# EAGLE schematic v1.0 (EAGLE 9.1.0)
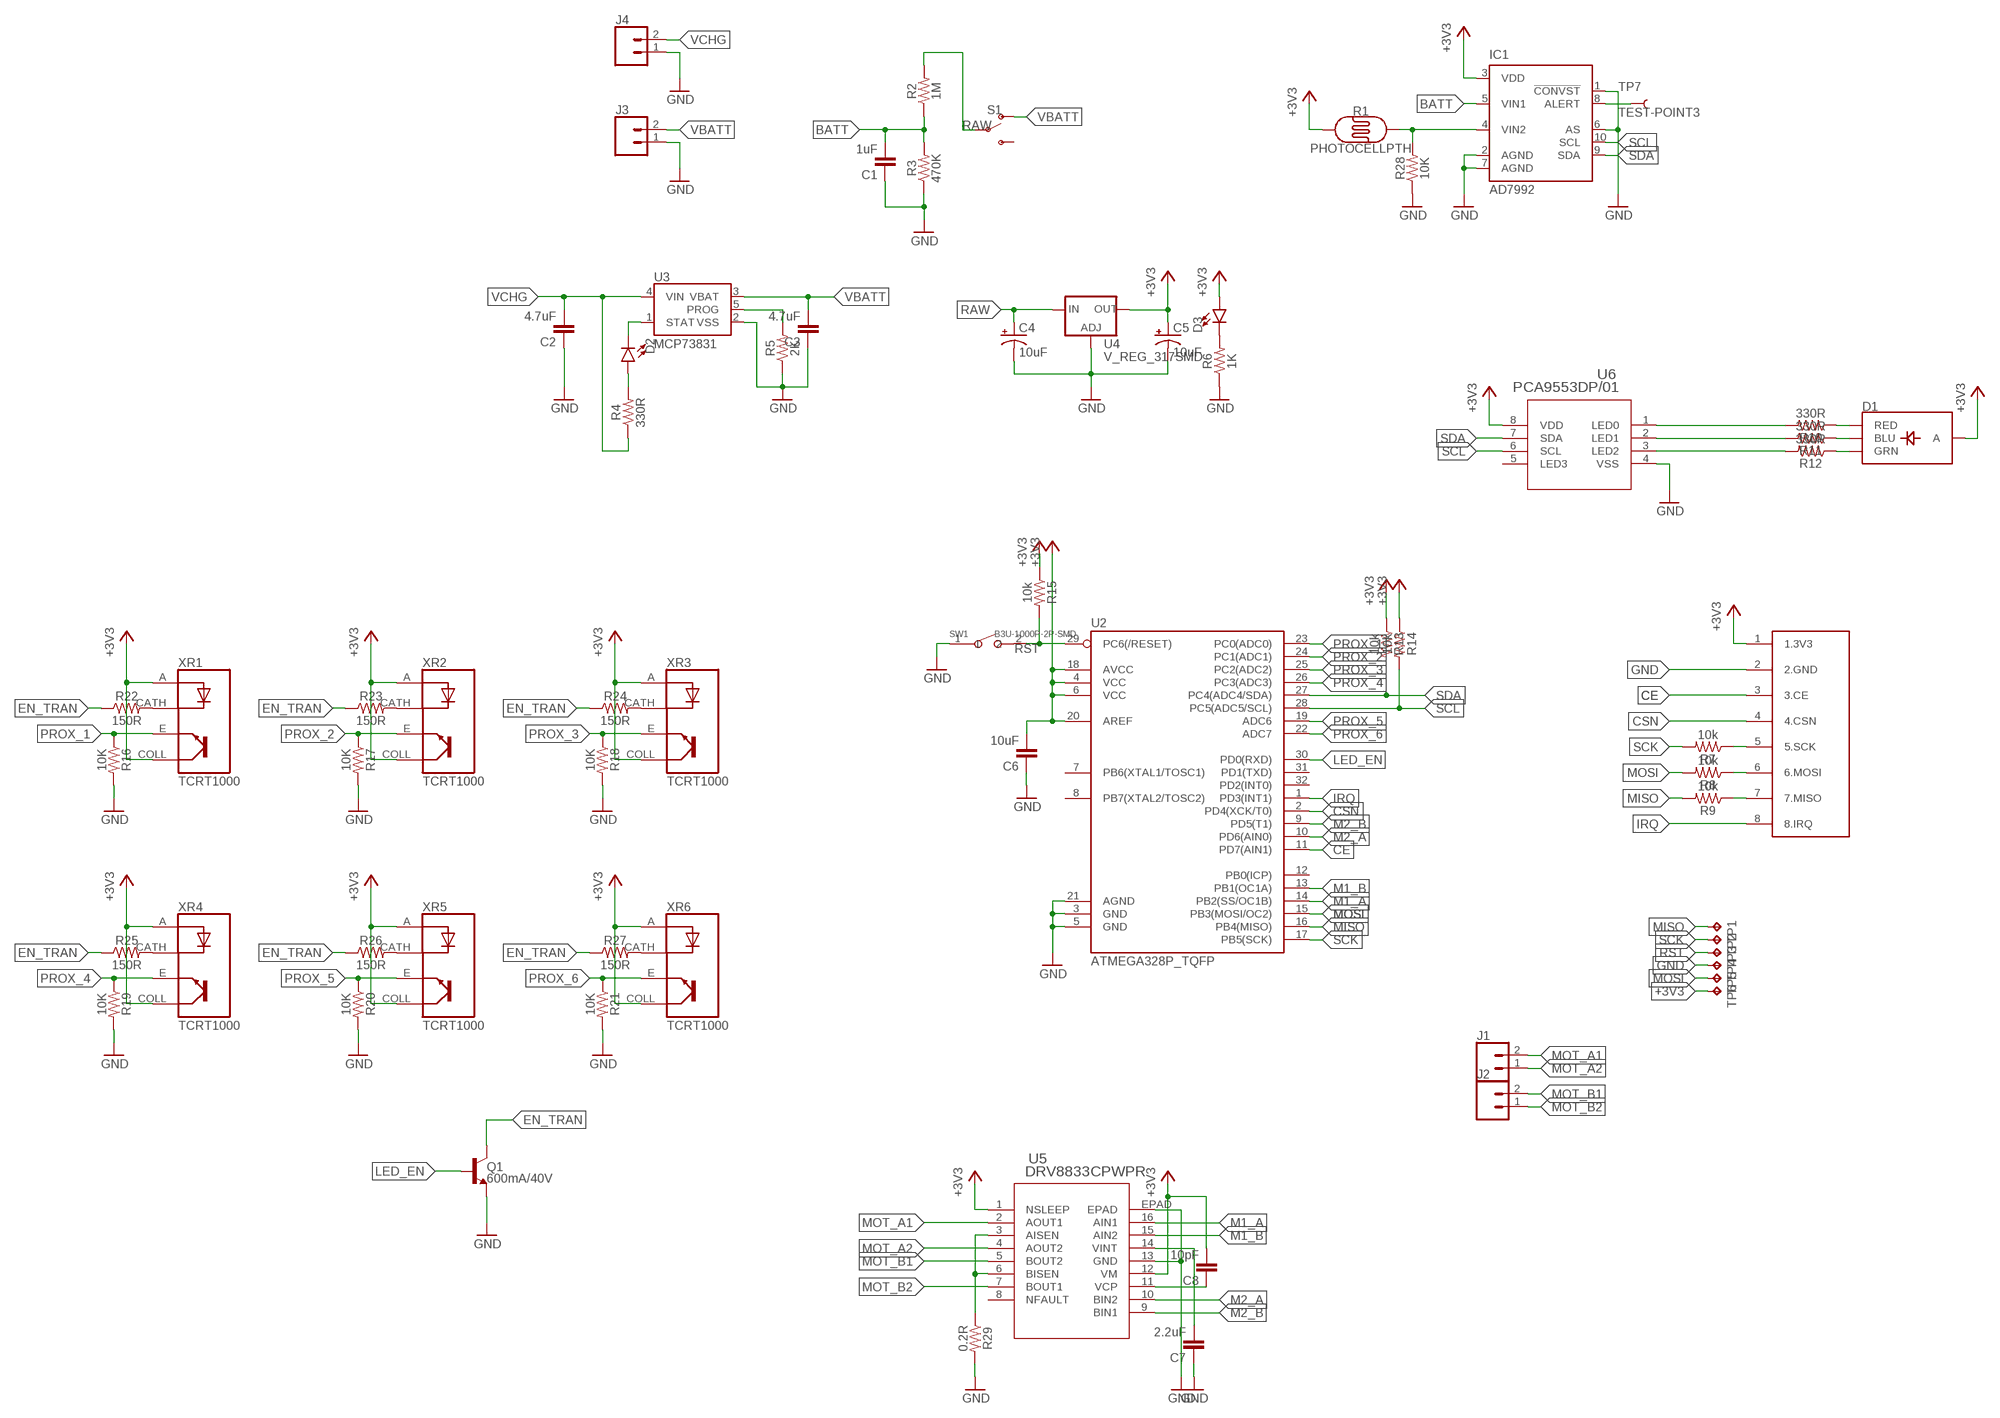
[diagram p0: schematic, sheet 1]

## Parts
C1  1uF  C-EUC0603  [C0603]
C2  4.7uF  C-EUC0603  [C0603]
C3  4.7uF  C-EUC0603  [C0603]
C4  10uF  10UF-POLAR-EIA3216-16V-10%(TANT)  [EIA3216]
C5  10uF  10UF-POLAR-EIA3216-16V-10%(TANT)  [EIA3216]
C6  10uF  C-EUC0603  [C0603]
C7  2.2uF  C-EUC0603  [C0603]
C8  10pF  C-EUC0603  [C0603]
D1  LED-RGB-CASMD  [LED-TRICOLOR-SMD]
D2  LED0603  [LED-0603]
D3  LED0603  [LED-0603]
IC1  AD7992  [MSOP10]
J1  CONN_02  [1X02]
J2  CONN_02  [1X02]
J3  CONN_02  [1X02]
J4  CONN_02  [1X02]
Q1  600mA/40V  TRANS_NPN-MMBT2222AL  [SOT23-3]
R1  PHOTOCELLPTH  [PHOTOCELL]
R2  1M  RESISTOR0402  [0402]
R3  470K  RESISTOR0402  [0402]
R4  330R  RESISTOR0402  [0402]
R5  2K  RESISTOR0402  [0402]
R6  1K  RESISTOR0402  [0402]
R7  10k  RESISTOR0402  [0402]
R8  10k  RESISTOR0402  [0402]
R9  10k  RESISTOR0402  [0402]
R10  330R  RESISTOR0402  [0402]
R11  330R  RESISTOR0402  [0402]
R12  330R  RESISTOR0402  [0402]
R13  10k  RESISTOR0402  [0402]
R14  10k  RESISTOR0402  [0402]
R15  10k  RESISTOR0402  [0402]
R16  10K  RESISTOR0402  [0402]
R17  10K  RESISTOR0402  [0402]
R18  10K  RESISTOR0402  [0402]
R19  10K  RESISTOR0402  [0402]
R20  10K  RESISTOR0402  [0402]
R21  10K  RESISTOR0402  [0402]
R22  150R  RESISTOR0402  [0402]
R23  150R  RESISTOR0402  [0402]
R24  150R  RESISTOR0402  [0402]
R25  150R  RESISTOR0402  [0402]
R26  150R  RESISTOR0402  [0402]
R27  150R  RESISTOR0402  [0402]
R28  10K  RESISTOR0402  [0402]
R29  0.2R  RESISTOR0402  [0402]
S1  SWITCH-SPDT-SMD-RIGHT-ANGLE  [SWITCH_SPST_SMD_A]
SW1  B3U-1000P-2P-SMD  SMD-BUTTON(2P-3.0X2.5X1.2+0.4MM)-B3U-1000P-2P-SMD  [SW2-2.6-3.0X2.5X1.2+0.4MM]
TP1  TPB1,27  [B1,27]
TP2  TPB1,27  [B1,27]
TP3  TPB1,27  [B1,27]
TP4  TPB1,27  [B1,27]
TP5  TPB1,27  [B1,27]
TP6  TPB1,27  [B1,27]
TP7  TEST-POINT3  [PAD.03X.03]
U2  ATMEGA328P_TQFP  [TQFP32-08]
U3  MCP73831  [SOT23-5]
U4  V_REG_317SMD  [SOT223]
U5  DRV8833CPWPR  [PWP16_2P31X2P46]
U6  PCA9553DP/01  [SOT505-1]
U$1  NRF24L01+  [NRF24L01+]
XR1  TCRT1000  [XDCR_TCRT1000]
XR2  TCRT1000  [XDCR_TCRT1000]
XR3  TCRT1000  [XDCR_TCRT1000]
XR4  TCRT1000  [XDCR_TCRT1000]
XR5  TCRT1000  [XDCR_TCRT1000]
XR6  TCRT1000  [XDCR_TCRT1000]

## Nets
+3V3: C5.+ C6.2 C8.2 D1.A D3.A IC1.3(VDD) R1.1 R13.1 R14.1 R15.1 TP6.TP U2.4(VCC) U2.6(VCC) U2.18(AVCC) U2.20(AREF) U4.2(OUT) U5.1(NSLEEP) U5.12(VM) U6.8(VDD) U$1.1(1.3V3) XR1.A XR1.COLL(CO) XR2.A XR2.COLL(CO) XR3.A XR3.COLL(CO) XR4.A XR4.COLL(CO) XR5.A XR5.COLL(CO) XR6.A XR6.COLL(CO)
BATT: C1.2 IC1.5(VIN1) R2.1 R3.2
CE: U2.11(PD7(AIN1)) U$1.3(3.CE)
CSN: U2.2(PD4(XCK/T0)) U$1.4(4.CSN)
EN_TRAN: Q1.3(C) R22.1 R23.1 R24.1 R25.1 R26.1 R27.1
GND: C1.1 C2.1 C3.1 C4.- C5.- C6.1 C7.1 IC1.1(!CONVST) IC1.2(AGND) IC1.6(AS) IC1.7(AGND) J3.1 J4.1 Q1.2(E) R3.1 R5.1 R6.1 R16.2 R17.2 R18.2 R19.2 R20.2 R21.2 R28.1 R29.2 SW1.1 TP4.TP U2.3(GND) U2.5(GND) U2.21(AGND) U3.2(VSS) U4.1(ADJ) U5.13(GND) U5.EPAD U6.4(VSS) U$1.2(2.GND)
IRQ: U2.1(PD3(INT1)) U$1.8(8.IRQ)
LED_EN: Q1.1(B) U2.30(PD0(RXD))
M1_A: U2.14(PB2(SS/OC1B)) U5.16(AIN1)
M1_B: U2.13(PB1(OC1A)) U5.15(AIN2)
M2_A: U2.10(PD6(AIN0)) U5.10(BIN2)
M2_B: U2.9(PD5(T1)) U5.9(BIN1)
MISO: R9.2 TP1.TP U2.16(PB4(MISO))
MOSI: R8.2 TP5.TP U2.15(PB3(MOSI/OC2))
MOT_A1: J1.2 U5.2(AOUT1)
MOT_A2: J1.1 U5.4(AOUT2)
MOT_B1: J2.2 U5.5(BOUT2)
MOT_B2: J2.1 U5.7(BOUT1)
N$1: R7.1 U$1.5(5.SCK)
N$2: R8.1 U$1.6(6.MOSI)
N$3: D3.C R6.2
N$4: D2.C U3.1(STAT)
N$5: D2.A R4.2
N$6: R9.1 U$1.7(7.MISO)
N$7: D1.R(RED) R10.1
N$8: D1.B(BLU) R11.1
N$9: R5.2 U3.5(PROG)
N$10: D1.G(GRN) R12.1
N$11: R29.1 U5.3(AISEN) U5.6(BISEN)
N$12: IC1.4(VIN2) R1.2 R28.2
N$13: IC1.8(ALERT) TP7.P$1
N$14: C7.2 U5.14(VINT)
N$15: C8.1 U5.11(VCP)
N$20: R22.2 XR1.CATH(C)
N$23: R23.2 XR2.CATH(C)
N$24: R24.2 XR3.CATH(C)
N$25: R25.2 XR4.CATH(C)
N$27: R26.2 XR5.CATH(C)
N$29: R27.2 XR6.CATH(C)
PROX_1: R16.1 U2.23(PC0(ADC0)) XR1.E
PROX_2: R17.1 U2.24(PC1(ADC1)) XR2.E
PROX_3: R18.1 U2.25(PC2(ADC2)) XR3.E
PROX_4: R19.1 U2.26(PC3(ADC3)) XR4.E
PROX_5: R20.1 U2.19(ADC6) XR5.E
PROX_6: R21.1 U2.22(ADC7) XR6.E
RAW: C4.+ R2.2 S1.2(P) U4.3(IN)
RGB-1: R10.2 U6.1(LED0)
RGB-2: R11.2 U6.2(LED1)
RGB-3: R12.2 U6.3(LED2)
RST: R15.2 SW1.2 TP3.TP U2.29(PC6(/RESET))
SCK: R7.2 TP2.TP U2.17(PB5(SCK))
SCL: IC1.10(SCL) R14.2 U2.28(PC5(ADC5/SCL)) U6.6(SCL)
SDA: IC1.9(SDA) R13.2 U2.27(PC4(ADC4/SDA)) U6.7(SDA)
VBATT: C3.2 J3.2 S1.1(O) U3.3(VBAT)
VCHG: C2.2 J4.2 R4.1 U3.4(VIN)
Unconnected: S1.3(S) U2.7(PB6(XTAL1/TOSC1)) U2.8(PB7(XTAL2/TOSC2)) U2.12(PB0(ICP)) U2.31(PD1(TXD)) U2.32(PD2(INT0)) U5.8(NFAULT) U6.5(LED3)

## Library data of the parts
C1-C3 C6-C8 = resistor:C-EU: CAPACITOR, European symbol
C4 C5 = SparkFun-Capacitors:10UF-POLAR: 10.0µF polarized capacitors A capacitor is a passive two-terminal electrical component used to store electrical energy temporarily in an electric field.; PROD_ID: CAP-00811
D1 = thesis:LED-RGB-CA: LED-RGB Diffused Common Anode Packages: LED RGB-THRU P-LCC-4-3 LED-TRICOLOR-SMD SparkFun Products: RGB Diffused Common Anode- Diffuse <[https://www.sparkfun.com/products/10821]> RGB Diffused Common Anode - Clear <[https://www.sparkfun.com/products/10820]> Qduino Mini <[https://www.sparkfun.com/products/13614]> Triple Output LED RGB - SMD <https://www.sparkfun.com/products/7844>; PROD_ID: DIO-08324
D2 D3 = SparkFun-LED:LED: LED (Generic) Standard schematic elements and footprints for 5mm, 3mm, 1206, and 0603 sized LEDs. Generic LEDs with no color specified.
IC1 = analog-devices:AD7992: 2-Channel, 12-Bit ADC with I2C-Compatible Interface 10-Lead MSOP Source: http://www.analog.com/UploadedFiles/Data_Sheets/224965274AD7992_0.pdf; MPN: AD7992BRMZ-0; OC_FARNELL: 1078311; OC_NEWARK: 31M4422
J1-J4 = SparkFun-Connectors:CONN_02: Multi connection point. Often used as Generic Header-pin footprint for 0.1 inch spaced/style header connections On any of the 0.1 inch spaced packages, you can populate with these: Break Away Headers - Straight <https://www.sparkfun.com/products/116> (PRT-00116) Break Away Male Headers - Right Angle <https://www.sparkfun.com/products/553> (PRT-00553) Female Headers <https://www.sparkfun.com/products/115> (PRT-00115) Break Away Headers - Machine Pin <https://www.sparkfun.com/products/117> (PRT-00117) Break Away Female Headers - Swiss Machine Pin <https://www.sparkfun.com/products/743> (PRT-00743) For SCREWTERMINALS and SPRING TERMINALS visit here: Screw Terimnals on SparkFun.com <https://www.sparkfun.com/search/results?term=Screw+Terminals> (5mm/3.5mm/2.54mm spacing) This device is also useful as a general connection point to wire up your design to another part of your project. Our various solder wires solder well into these plated through hole pads. Hook-Up Wire - Assortment (Stranded, 22 AWG) <https://www.sparkfun.com/products/11375> (PRT-11375) Hook-Up Wire - Assortment (Solid Core, 22 AWG) <https://www.sparkfun.com/products/11367> (PRT-11367) View the entire wire category on our website here <https://www.sparkfun.com/categories/141> Special notes: Molex polarized connector foot print use with: PRT-08233 with associated crimp pins and housings. 2.54_SCREWTERM for use with PRT-10571. 3.5mm Screw Terminal footprints for PRT-08084 5mm Screw Terminal footprints for use with PRT-08432
Q1 = SparkFun-DiscreteSemi:TRANS_NPN: NPN transistor Current controlled devices typically used to amplify current or used as a switch. BC547 - COM-08928 <http://www.sparkfun.com/products/8928> (TO-92 45V 100mA) (1.Collector 2.Base 3.Emitter) 2N3904 - COM-00521 <http://www.sparkfun.com/products/521> (TO-92 40V 200mA) (1.Emitter 2.Base 3.Collector) P2N2222A - COM-12852 <http://www.sparkfun.com/products/12852> (TO-92 40V 600mA) (1.Collector 2.Base 3.Emitter); PROD_ID: TRANS-08049
R1 = SparkFun-Sensors:PHOTOCELL: Photocell (Photodetector, Photo Resistor, CdS) This is a very small light sensor. A photocell changes (also called a photodetector, photo resistor, CdS or photoconductive cell) resistance depending on the amount of light it is exposed to. These little sensors make great ambient light triggers (when light in the room turns on, do something). Datasheet <http://cdn.sparkfun.com/datasheets/Sensors/LightImaging/SEN-09088.pdf> SparkFun Products Mini Photocell <https://www.sparkfun.com/products/9088> (SEN-09088); PROD_ID: COMP-09129; SF_ID: SEN-09088
R2-R29 = SparkFun-Resistors:RESISTOR: Generic Resistor Package
S1 = SparkFun-Switches:SWITCH-SPDT: Single Pole, Double Throw (SPDT) Switch Single-pole, double-throw (SPDT) switch. Variant Overview SMD-AYZ0202 Surface Mount DPDT Switch <https://www.sparkfun.com/products/597> (COM-00597) Used on e.g. LilyPad Arduino USB - ATmega32U4 Board <https://www.sparkfun.com/products/12049> PTH-11.6X4.0MM SPDT Mini Power Switch <https://www.sparkfun.com/products/102> (COM-00102) Used on e.g. SparkFun Simon Says - Through-Hole Soldering Kit <https://www.sparkfun.com/products/10547> (KIT-10547) PTH-11.6X4.0MM-KIT KIT version of SPDT Mini Power Switch - Simplifies soldering by removing tStop of switch pins - only one side can be soldered. PTH-11.6X4.0MM-LOCK LOCK version of SPDT Mini Power Switch - Offset pins hold switch in place for easier soldering. SMD-RIGHT-ANGLE Surface Mount Right Angle Switch <https://www.sparkfun.com/products/10860> (COM-10860) Used on e.g. SparkFun ESP8266 Thing <https://www.sparkfun.com/products/13231>; PROD_ID: SWCH-10651; SF_SKU: COM-10860
SW1 = Seeed-Switch:SMD-BUTTON(2P-3.0X2.5X1.2+0.4MM): 311020047; MPN: B3U-1000P-2P-SMD
TP1-TP6 = testpad:TP: Test pad
TP7 = SparkFun-Connectors:TEST-POINT: SparkFun Test Points Bare copper test points for troubleshooting or In-Circuit-Testing. These are used by our Production team for verifying production board runs using pogo-pins on test beds. SparkFun Products: SparkFun LSM9DS1 Breakout <https://www.sparkfun.com/products/13284> SparkFun PSOC <https://www.sparkfun.com/products/13714> SparkFun Load Cell Amplifier <https://www.sparkfun.com/products/13879>
U2 = thesis:ATMEGA328P_TQFP: Popular 328P in QFP Storefront component: ATmega328 - TQFP <https://www.sparkfun.com/products/13448> (COM-13448) Datasheet <http://www.sparkfun.com/datasheets/Components/SMD/ATMega328.pdf> SparkFun Products SparkFun RedBoard - Programmed with Arduino <https://www.sparkfun.com/products/12757> (DEV-12757) Arduino Pro Mini 328 - 5V/16MHz <https://www.sparkfun.com/products/11113> (DEV-11113) Arduino Pro Mini 328 - 3.3V/8MHz <https://www.sparkfun.com/products/11114> (DEV-11114) SparkFun OpenLog <https://www.sparkfun.com/products/13712> (DEV-13712) SparkFun MicroView - OLED Arduino Module <https://www.sparkfun.com/products/12923> (DEV-12923) SparkFun Digital Sandbox <https://www.sparkfun.com/products/12651> (DEV-12651) SparkFun PicoBoard <https://www.sparkfun.com/products/11888> (WIG-11888) Arduino Fio <https://www.sparkfun.com/products/10116> (DEV-10116) LilyPad Arduino 328 Main Board <https://www.sparkfun.com/products/13342> (DEV-13342) SparkFun RedStick <https://www.sparkfun.com/products/13741> (DEV-13741) LilyPad MP3 <https://www.sparkfun.com/products/11013> (DEV-11013) LilyPad Arduino SimpleSnap <https://www.sparkfun.com/products/10941> (DEV-10941) SparkFun Stepoko <https://www.sparkfun.com/products/13899> (ROB-13899) SparkFun Geiger Counter <https://www.sparkfun.com/products/11345> (SEN-11345) SparkFun EL Sequencer <https://www.sparkfun.com/products/12781> (COM-12781) Arduino Pro 328 - 5V/16MHz <https://www.sparkfun.com/products/10915> (DEV-10915) CryptoCape <https://www.sparkfun.com/products/12773> (DEV-12773) SparkFun IR Thermometer Evaluation Board - MLX90614 <https://www.sparkfun.com/products/10740> (SEN-10740) SparkFun RedBot Mainboard <https://www.sparkfun.com/products/12097> (ROB-12097) Arduino Pro 328 - 3.3V/8MHz <https://www.sparkfun.com/products/10914> (DEV-10914) SparkFun Block for Intel® Edison - Arduino <https://www.sparkfun.com/products/13036> (DEV-13036) SparkFun Simon Says - Surface Mount Soldering Kit <https://www.sparkfun.com/products/10935> (KIT-10935) SparkFun 7-Segment Serial Display - Red <https://www.sparkfun.com/products/11441> (COM-11441) SparkFun 7-Segment Serial Display - White <https://www.sparkfun.com/products/11629> (COM-11629) SparkFun 7-Segment Serial Display - Yellow <https://www.sparkfun.com/products/11443> (COM-11443) SparkFun 7-Segment Serial Display - Kelly Green <https://www.sparkfun.com/products/11440> (COM-11440) SparkFun 7-Segment Serial Display - Blue <https://www.sparkfun.com/products/11442> (COM-11442) SparkFun OpenSegment Serial Display - 20mm (Blue) <https://www.sparkfun.com/products/11647> (COM-11647) SparkFun OpenSegment Serial Display - 20mm (Green) <https://www.sparkfun.com/products/11646> (COM-11646) SparkFun OpenSegment Serial Display - 20mm (White) <https://www.sparkfun.com/products/11648> (COM-11648) SparkFun OpenSegment Serial Display - 20mm (Red) <https://www.sparkfun.com/products/11644> (COM-11644) SparkFun OpenSegment Serial Display - 20mm (Yellow) <https://www.sparkfun.com/products/11645> (COM-11645) SparkFun OpenSegment Shield <https://www.sparkfun.com/products/13190> (DEV-13190); PROD_ID: IC-09069
U3 = SparkFun-IC-Power:MCP73831: MCP73831T Li-Ion, Li-Pol Controller Miniature single cell, fully integrated Li-Ion, Li-polymer charge management controller Datasheet <http://ww1.microchip.com/downloads/en/DeviceDoc/20001984g.pdf> SparkFun Products: SparkFun ESP32 Thing <https://www.sparkfun.com/products/13907> SparkFun 9DoF Razor IMU M0 <https://www.sparkfun.com/products/14001>; PROD_ID: IC-09995
U4 = SparkFun-IC-Power:V_REG_317: Voltage Regulator Standard LM317 adjustable voltage regulator. AOI (Adjust Output Input). Google 'LM317 Calculator' for easy to use app to get the two resistor values needed. 240/720 for 5V output. 240/390 for 3.3V output. Spark Fun Electronics SKU : COM-00527
U5 = thesis:DRV8833CPWPR; MANUFACTURER_PART_NUMBER: DRV8833CPWPR; VENDOR: Texas Instruments
U6 = thesis:PCA9553DP/01; MANUFACTURER_PART_NUMBER: PCA9553DP01; VENDOR: NXP
U$1 = thesis:NRF24L01+
XR1-XR6 = thesis:TCRT1000: Optical Sensor The TCRT1000 and TCRT1010 are reflective sensors which include an infrared emitter and phototransistor in a leaded package which blocks visible light; AVAILABILITY: Unavailable; DESCRIPTION: 950 nm 50 mA Through Hole Reflective Optical Sensor with Transistor Output; MF: Vishay; MP: TCRT1000; PACKAGE: PCB Mount Vishay; PRICE: None